# EAGLE design RC (EAGLE 6.3)
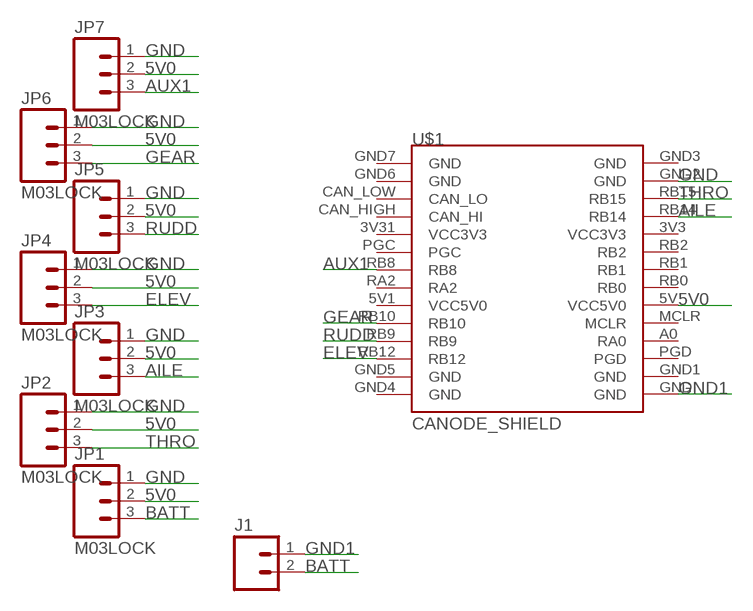
[diagram p0: schematic, sheet 1]

## Parts
J1  M02LOCK  [1X02_LOCK]
JP1  M03LOCK  [1X03_LOCK]
JP2  M03LOCK  [1X03_LOCK]
JP3  M03LOCK  [1X03_LOCK]
JP4  M03LOCK  [1X03_LOCK]
JP5  M03LOCK  [1X03_LOCK]
JP6  M03LOCK  [1X03_LOCK]
JP7  M03LOCK  [1X03_LOCK]
U$1  CANODE_SHIELD  [CANODE_SHIELD]

## Nets
5V0: JP1.2 JP2.2 JP3.2 JP4.2 JP5.2 JP6.2 JP7.2 U$1.5V(VCC5V0)
AILE [small]: JP3.3 U$1.RB14
AUX1: JP7.3 U$1.RB8
BATT: J1.2 JP1.3
ELEV [small]: JP4.3 U$1.RB12
GEAR [small]: JP6.3 U$1.RB10
GND: JP1.1 JP2.1 JP3.1 JP4.1 JP5.1 JP6.1 JP7.1 U$1.GND2(GND)
GND1: J1.1 U$1.GND
RUDD: JP5.3 U$1.RB9
THRO: JP2.3 U$1.RB15
Unconnected: U$1.3V3(VCC3V3) U$1.3V31(VCC3V3) U$1.5V1(VCC5V0) U$1.A0(RA0) U$1.CAN_HIGH(CAN_HI) U$1.CAN_LOW(CAN_LO) U$1.GND1(GND) U$1.GND3(GND) U$1.GND4(GND) U$1.GND5(GND) U$1.GND6(GND) U$1.GND7(GND) U$1.MCLR U$1.PGC U$1.PGD U$1.RA2 U$1.RB0 U$1.RB1 U$1.RB2

## Library data of the parts
J1 = ASL:M02: Header 2 Standard 2-pin 0.1" header. Use with straight break away headers (SKU : PRT-00116), right angle break away headers (PRT-00553), swiss pins (PRT-00743), machine pins (PRT-00117), and female headers (PRT-00115). Molex polarized connector foot print use with SKU : PRT-08233 with associated crimp pins and housings.
JP1-JP7 = ASL:M03: Header 3 Standard 3-pin 0.1" header. Use with straight break away headers (SKU : PRT-00116), right angle break away headers (PRT-00553), swiss pins (PRT-00743), machine pins (PRT-00117), and female headers (PRT-00115). Molex polarized connector foot print use with SKU : PRT-08232 with associated crimp pins and housings.
U$1 = ASL:CANODE_SHIELD: This part provides an outline of the CANode to facilitate developing shield boards. Note that this does not show the position of the mounting holes for the 4-40 screws, which should be .12" holes centered in the 4 circles in the corners.

## Net classes
0 default: width 0.406 mm
1 small: width 0.203 mm

## Board
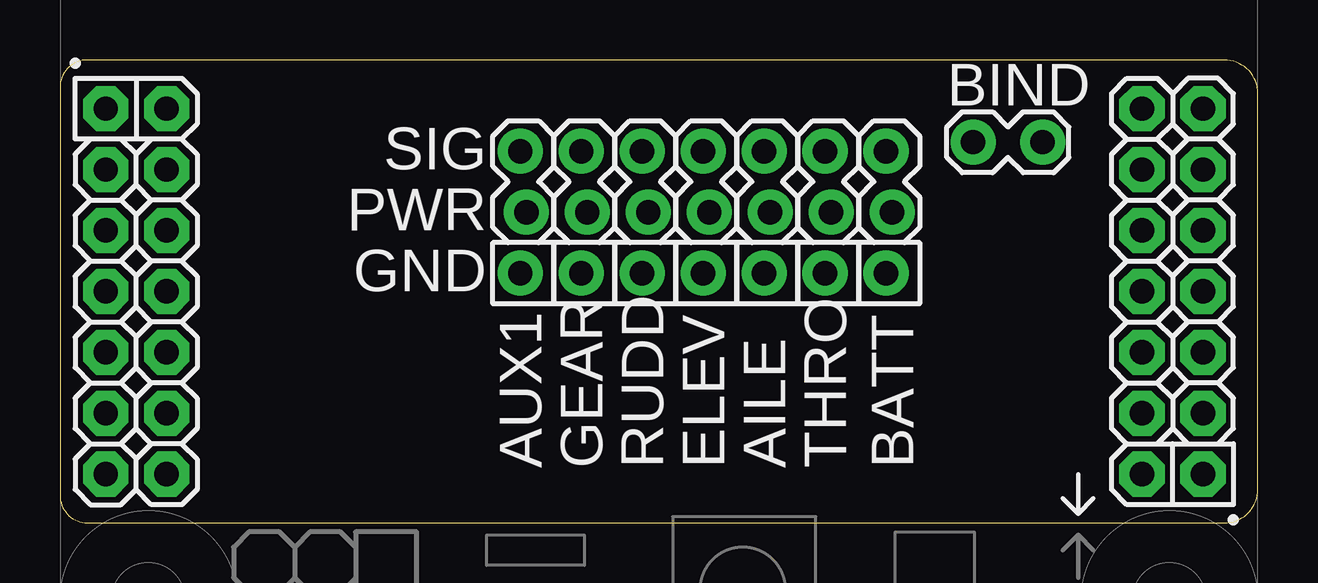
[diagram p1: board, top side]
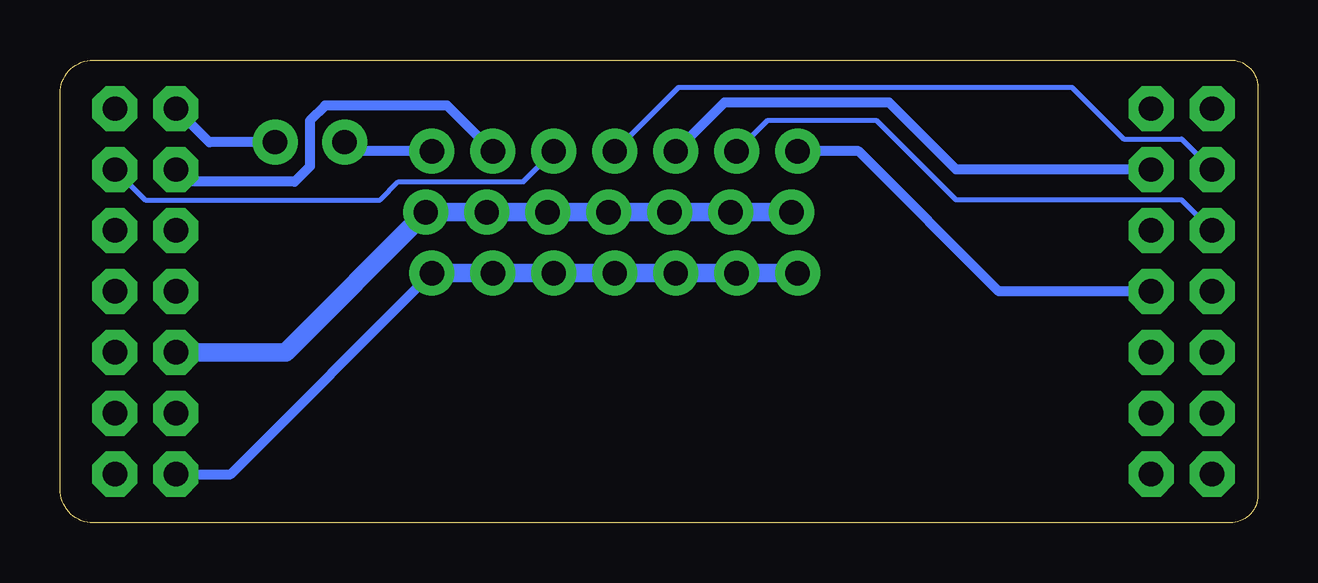
[diagram p2: board, bottom side, seen from below]

Size 49.91 x 19.3 mm. Coordinates in mm from the lower left corner, seen from the top.
Outline: 0,18.16 0,1.14 arc90 1.14,0 48.51,0 arc90 49.91,1.4 49.91,17.91 arc90 48.51,19.3 1.14,19.3 arc90 0,18.16
Copper layers (1*16): Top 0.035mm / dielectric 1.5mm / Bottom 0.035mm
Design rules "default *": minimum track width 8mil, minimum drill 0.6mm, track to track 10mil, track to pad 8mil, pad to pad 8mil, via to via 8mil, smd to smd 8mil, copper to edge 30mil, drill to drill 8mil, minimum pad ring 10mil, minimum via ring 20mil, stop-mask expansion 4mil, vias tented up to drill 0mil, thermal gap 10mil

### Footprints (pad centres in the part's own frame; a part is rotated, then mirrored left to right if it is on the bottom)
1X02_LOCK = drill 1.016 pad 1.88: 1 -0.178,0; 2 2.718,0
1X03_LOCK = drill 1.016 pad 1.88: 1 0,0.127; 2 2.54,-0.127; 3 5.08,0.127
CANODE_SHIELD = drill 1.016 pad 1.88 octagon: 3V3 45.085,19.05; 3V31 4.445,13.97; 5V 45.085,13.97; 5V1 4.445,19.05; A0 45.085,11.43; CAN_HIGH 1.905,11.43; CAN_LOW 4.445,11.43; GND 45.085,24.13; GND1 47.625,24.13; GND2 45.085,8.89; GND3 47.625,8.89; GND4 4.445,8.89; GND5 1.905,8.89; GND6 4.445,24.13; GND7 1.905,24.13; MCLR 47.625,13.97; PGC 1.905,13.97; PGD 47.625,11.43; RA2 1.905,16.51; RB0 47.625,16.51; RB1 45.085,16.51; RB2 47.625,19.05; RB8 4.445,16.51; RB9 4.445,21.59; RB10 1.905,19.05; RB12 1.905,21.59; RB14 47.625,21.59; RB15 45.085,21.59

### Placement (x,y rotation side)
J1  40.77,15.88 180 top
JP1  34.54,10.41 90 top
JP2  32,10.41 90 top
JP3  29.46,10.41 90 top
JP4  26.92,10.41 90 top
JP5  24.38,10.41 90 top
JP6  21.84,10.41 90 top
JP7  19.3,10.41 90 top
U$1  0,-6.86 0 top

### Tracks (layer width: path | path; a pad name or v marks a point on that pad's centre or on a via)
5V0
  Bottom 0.762: JP7.2 JP6.2 JP5.2 JP4.2 JP3.2 JP2.2 JP1.2 40.51,7.11 U$1.5V
AILE
  Bottom 0.203: U$1.RB14 46.35,13.46 36.58,13.46 35.81,14.22 30.61,14.22 JP3.3
AUX1
  Bottom 0.406: U$1.RB8 10.79,9.65 16.64,15.49 JP7.3
BATT
  Bottom 0.406: JP1.3 37.72,15.49 J1.2
ELEV
  Bottom 0.203: JP4.3 24.13,18.16 7.75,18.16 5.59,16 3.17,16 U$1.RB12
GEAR
  Bottom 0.203: U$1.RB10 3.17,13.46 12.57,13.46 15.88,16.76 20.45,16.76 JP6.3
GND
  Bottom 0.406: U$1.GND2 42.8,2.03 JP1.1
  Bottom 0.762: JP1.1 JP2.1 JP3.1 JP4.1 JP5.1 JP6.1 JP7.1
GND1
  Bottom 0.406: J1.1 43.69,15.88 U$1.GND
RUDD
  Bottom 0.406: U$1.RB9 12.57,14.73 15.37,17.53 22.23,17.53 JP5.3
THRO
  Bottom 0.406: JP2.3 33.78,17.4 38.86,17.4 39.5,16.76 39.5,14.86 40.13,14.22 44.58,14.22 U$1.RB15

### Text on the board
tPlace: BIND | SIG | PWR | GND | AUX1 | GEAR | RUDD | ELEV | AILE | THRO | BATT